# Altium schematic sheet OLED Display.SchDoc
size B; SheetNumber: 7; SheetTotal: 7
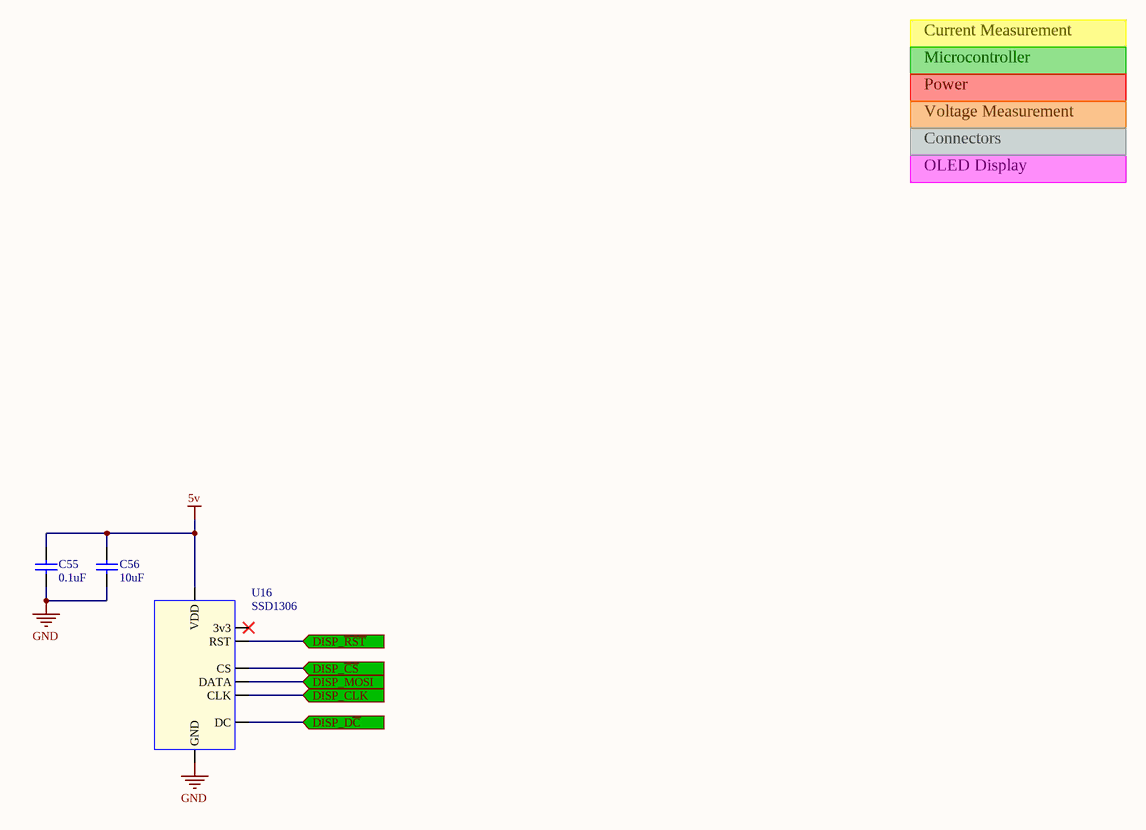
[diagram p0: OLED Display.SchDoc]

## Parts
C55  0.1uF  [CAP0402R]
C56  10uF  [CAP1206R]
U16  SSD1306  [SSD1306]

## Ports
DISP_CLK (in), DISP_D~{C} (in), DISP_MOSI (in), DISP_~{CS} (in), DISP_~{RST} (in)

## Nets
5v: C55.1 C56.1 U16.7(VDD)
GND: C55.2 C56.2 U16.8(GND)
DISP_~{CS}: U16.5(CS) ; port DISP_~{CS}
DISP_CLK: U16.2(CLK) ; port DISP_CLK
DISP_D~{C}: U16.3(DC) ; port DISP_D~{C}
DISP_MOSI: U16.1(DATA) ; port DISP_MOSI
DISP_~{RST}: U16.4(RST) ; port DISP_~{RST}

Not connected (* = marked no-connect by the designer): U16 6(3v3)*

## Notes on the sheet
- Current Measurement
- Microcontroller
- Power
- Voltage Measurement
- OLED Display
- Connectors

## Library data of the parts
C55 = 0.1uF (0402): Tolerance: 20%; MFG_PN: VJ0402G104MXQCW1BC; MFG: Vishay; Voltage: 10v; LOAD: NL; Value: 0.1uF
C56 = 10uF: MFG1_PN: VJ1206V106ZXQTW1BC; MFG1: Vishay; Value: 10uF
U16 = SSD1306: OLED Display; MFG: ADAFRUIT; MFG_PN: SSD1306